# Altium schematic sheet P1.schdoc
size 297 x 209 mm; Symbol: Drawing-Symbol_A4; @Project Name: New Project_2026-08-12_18-40-16; @Page Count: 1; @Update Date: 2026-08-12; @Create Date: 2026-08-12; @Schematic Name: Schematic1; @Page No: 1; @Page Name: P1; Company: EasyEDA.com; Version: V1.0; Page Size: A4; Device: Drawing-Symbol_A4; @Create Time: 18:40:18; @Update Time: 18:40:18; Border: 1; Width: 1170; Height: 825; Region Start: 1; X Region Count: 6; Y Region Count: 4; Blade Width: 10; Title Block Position: 3; @Board Name: Board1
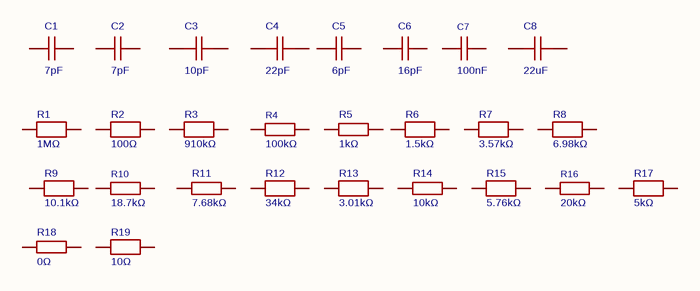
[diagram p0: P1.schdoc]

## Parts
C1  7pF  [C0603]
C2  7pF  [C0603]
C3  10pF  [C0805]
C4  22pF  [C0805]
C5  6pF  [C0805]
C6  16pF  [C0805]
C7  100nF  [C0805]
C8  22uF  [C0805]
R1  1MΩ  [R0805]
R2  100Ω  [R0805]
R3  910kΩ  [R0805]
R4  100kΩ  [R0805]
R5  1kΩ  [R0805]
R6  1.5kΩ  [R0805]
R7  3.57kΩ  [R0805]
R8  6.98kΩ  [R0805]
R9  10.1kΩ  [R0805]
R10  18.7kΩ  [R0805]
R11  7.68kΩ  [R0805]
R12  34kΩ  [R0805]
R13  3.01kΩ  [R0805]
R14  10kΩ  [R0805]
R15  5.76kΩ  [R0805]
R16  20kΩ  [R0805]
R17  5kΩ  [R0805]
R18  0Ω  [R0805]
R19  10Ω  [R0805]

## Nets

Not connected (* = marked no-connect by the designer): C1 1 2; C2 1 2; C3 1 2; C4 1 2; C5 1 2; C6 1 2; C7 1 2; C8 1 2; R1 1 2; R2 1 2; R3 1 2; R4 1 2; R5 1 2; R6 1 2; R7 1 2; R8 1 2; R9 1 2; R10 1 2; R11 1 2; R12 1 2; R13 1 2; R14 1 2; R15 1 2; R16 1 2; R17 1 2; R18 1 2; R19 1 2

## Notes on the sheet
- Create at
- 2026-08-12
- Schematic
- Board
- Schematic1
- Board1
- Update at
- Page
- P1
- Drawn
- Reviewed
- New Project_2026-08-12_18-40-16
- Version
- V1.0
- Size
- A4
- Page  1  Total  1
- EasyEDA.com

## Library data of the parts
C1 C2 = 0603CG7R0C500NT: Capacitance:7pF Voltage Rating:50V Temperature Coefficient:C0G; Manufacturer: FH(风华); AddInBom: yes; ModelId: 624118aa3cc7497086c383c2d72e08520819f05c4eef4c71ace90d822a990e87; ModelName: C0603_L1.6-W0.8-H0.8; ModelTransform: 62.992,31.496,0,0,0,0,0,0,0; Voltage Rating: 50V; Temperature Coefficient: C0G; Symbol: 0603CG7R0C500NT; Device: 0603CG7R0C500NT; LCSC Part Name: ±0.25pF 7pF 50V; SupplierPart: C1682; ManufacturerPart: 0603CG7R0C500NT; Supplier Footprint: 0603; JLCPCB Part Class: Extended Part; Datasheet: https://item.szlcsc.com/datasheet/0603CG7R0C500NT/2034.html; Supplier: LCSC; ConvertToPcb: yes; FootprintName: C0603; Value: 7pF
C3 = VJ0805A100FXACW1BC: Capacitance:10pF Tolerance:±1% Tolerance:±1% Voltage Rating:50V Temperature Coefficient:C0G; Manufacturer: VISHAY(威世); AddInBom: yes; ModelId: 8c88e81f49c6409b980720ec8953afb60819f05c4eef4c71ace90d822a990e87; ModelName: C0805_L2.0-W1.3-H1.3; ModelTransform: 78.74,51.181,0,0,0,0,0,0.0005,0; Tolerance: ±1%; Voltage Rating: 50V; Temperature Coefficient: C0G; Symbol: VJ0805A100FXACW1BC; Device: VJ0805A100FXACW1BC; LCSC Part Name: 10pF ±1% 50V; SupplierPart: C2177610; ManufacturerPart: VJ0805A100FXACW1BC; Supplier Footprint: 0805; JLCPCB Part Class: Extended Part; Datasheet: https://item.szlcsc.com/datasheet/VJ0805A100FXACW1BC/2269676.html; Supplier: LCSC; ConvertToPcb: yes; FootprintName: C0805; Value: 10pF
C4 = 0805CG220F500NT: Capacitance:22pF Tolerance:±1% Tolerance:±1% Voltage Rating:50V Temperature Coefficient:C0G; Manufacturer: FH(风华); AddInBom: yes; ModelId: 8c88e81f49c6409b980720ec8953afb60819f05c4eef4c71ace90d822a990e87; ModelName: C0805_L2.0-W1.3-H1.3; ModelTransform: 78.74,51.181,0,0,0,0,0,0.0005,0; Tolerance: ±1%; Voltage Rating: 50V; Temperature Coefficient: C0G; Symbol: 0805CG220F500NT; Device: 0805CG220F500NT; LCSC Part Name: 22pF ±1% 50V; SupplierPart: C190088; ManufacturerPart: 0805CG220F500NT; Supplier Footprint: 0805; JLCPCB Part Class: Extended Part; Datasheet: https://item.szlcsc.com/datasheet/0805CG220F500NT/208470.html; Supplier: LCSC; ConvertToPcb: yes; FootprintName: C0805; Value: 22pF
C5 = 0805CG6R0C500NT_C67560: Capacitance:6pF Voltage Rating:50V Temperature Coefficient:C0G; Manufacturer: FH(风华); AddInBom: yes; ModelId: 8c88e81f49c6409b980720ec8953afb60819f05c4eef4c71ace90d822a990e87; ModelName: C0805_L2.0-W1.3-H1.3; ModelTransform: 78.74,51.181,0,0,0,0,0,0.0005,0; Voltage Rating: 50V; Temperature Coefficient: C0G; Symbol: 0805CG6R0C500N; Device: 0805CG6R0C500NT_C67560; LCSC Part Name: ±0.25pF 6pF 50V; SupplierPart: C67560; ManufacturerPart: 0805CG6R0C500NT; Supplier Footprint: 0805; JLCPCB Part Class: Extended Part; Datasheet: https://item.szlcsc.com/datasheet/0805CG6R0C500NT/68656.html; Supplier: LCSC; ConvertToPcb: yes; FootprintName: C0805; Value: 6pF
C6 = 0805CG160J500NT: Capacitance:16pF Tolerance:±5% Tolerance:±5% Voltage Rating:50V Temperature Coefficient:C0G; Manufacturer: FH(风华); AddInBom: yes; ModelId: 8c88e81f49c6409b980720ec8953afb60819f05c4eef4c71ace90d822a990e87; ModelName: C0805_L2.0-W1.3-H1.3; ModelTransform: 78.74,51.181,0,0,0,0,0,0.0005,0; Tolerance: ±5%; Voltage Rating: 50V; Temperature Coefficient: C0G; Symbol: 0805CG160J500NT; Device: 0805CG160J500NT; LCSC Part Name: 16pF ±5% 50V; SupplierPart: C1796; ManufacturerPart: 0805CG160J500NT; Supplier Footprint: 0805; JLCPCB Part Class: Extended Part; Datasheet: https://item.szlcsc.com/datasheet/0805CG160J500NT/2148.html; Supplier: LCSC; ConvertToPcb: yes; FootprintName: C0805; Value: 16pF
C7 = CC0805JRX7R9BB104: Capacitance:100nF Tolerance:±5% Tolerance:±5% Voltage Rating:50V Temperature Coefficient:X7R; Manufacturer: YAGEO(国巨); AddInBom: yes; ModelId: 8c88e81f49c6409b980720ec8953afb60819f05c4eef4c71ace90d822a990e87; ModelName: C0805_L2.0-W1.3-H1.3; ModelTransform: 78.74,51.181,0,0,0,0,0,0.0005,0; Tolerance: ±5%; Voltage Rating: 50V; Temperature Coefficient: X7R; Symbol: CC0805JRX7R9BB104; Device: CC0805JRX7R9BB104; Supplier: LCSC; Manufacturer Part: CC0805JRX7R9BB104; Value: 100nF; Supplier Part: C111492; JLCPCB Part Class: Extended Part; LCSC Part Name: 100nF ±5% 50V; Supplier Footprint: 0805; Datasheet: https://item.szlcsc.com/datasheet/CC0805JRX7R9BB104/112720.html; ConvertToPcb: yes; FootprintName: C0805
C8 = TCC0805X5R226K100FT: Capacitance:22uF Tolerance:±10% Tolerance:±10% Voltage Rating:10V Temperature Coefficient:X5R; Manufacturer: CCTC(三环); AddInBom: yes; ModelId: 8c88e81f49c6409b980720ec8953afb60819f05c4eef4c71ace90d822a990e87; ModelName: C0805_L2.0-W1.3-H1.3; ModelTransform: 78.74,51.181,0,0,0,0,0,0.0005,0; Tolerance: ±10%; Voltage Rating: 10V; Temperature Coefficient: X5R; Symbol: TCC0805X5R226K100FT; Device: TCC0805X5R226K100FT; LCSC Part Name: 22uF ±10% 10V; SupplierPart: C380336; ManufacturerPart: TCC0805X5R226K100FT; Supplier Footprint: 0805; JLCPCB Part Class: Extended Part; Datasheet: https://item.szlcsc.com/datasheet/TCC0805X5R226K100FT/352741.html; Supplier: LCSC; ConvertToPcb: yes; FootprintName: C0805; Value: 22uF
R1 = FRC0805F1004TS: Type:Thick Film Resistor Resistance:1MΩ Tolerance:±1% Tolerance:±1% Power(Watts):125mW Voltage-Supply(Max):150V Temperature Coefficient:±100ppm/℃ Temperature Coefficient:±100ppm/℃ Operating Temperature:-55℃~+155℃ Operating Temperature:-55℃~+155℃; Manufacturer: FOJAN(富捷); AddInBom: yes; ModelId: b83c7c5430874b8eb2319a65d94334290819f05c4eef4c71ace90d822a990e87; ModelName: R0805_L2.0-W1.3-H0.6; ModelTransform: 78.74,51.181,0,0,0,0,0,-0.0005,0; Tolerance: ±1%; Power(Watts): 125mW; Voltage-Supply(Max): 150V; Symbol: FRC0805F1004TS; Device: FRC0805F1004TS; LCSC Part Name: 1MΩ ±1% 125mW 厚膜电阻; SupplierPart: C2933280; ManufacturerPart: FRC0805F1004TS; Supplier Footprint: 0805; JLCPCB Part Class: Extended Part; Supplier: LCSC; ConvertToPcb: yes; FootprintName: R0805; Type: Thick Film Resistor; Value: 1MΩ; Temperature Coefficient: ±100ppm/℃; Operating Temperature: -55℃~+155℃
R2 = FRC0805F1000TS: Type:Thick Film Resistor Resistance:100Ω Tolerance:±1% Tolerance:±1% Power(Watts):125mW Voltage-Supply(Max):150V Temperature Coefficient:±100ppm/℃ Temperature Coefficient:±100ppm/℃ Operating Temperature:-55℃~+155℃ Operating Temperature:-55℃~+155℃; Manufacturer: FOJAN(富捷); AddInBom: yes; ModelId: b83c7c5430874b8eb2319a65d94334290819f05c4eef4c71ace90d822a990e87; ModelName: R0805_L2.0-W1.3-H0.6; ModelTransform: 78.74,51.181,0,0,0,0,0,-0.0005,0; Tolerance: ±1%; Power(Watts): 125mW; Voltage-Supply(Max): 150V; Symbol: FRC0805F1000TS; Device: FRC0805F1000TS; LCSC Part Name: 100Ω ±1% 125mW 厚膜电阻; SupplierPart: C2907218; ManufacturerPart: FRC0805F1000TS; Supplier Footprint: 0805; JLCPCB Part Class: Extended Part; Datasheet: https://item.szlcsc.com/datasheet/FRC0805F1000TS/3180731.html; Supplier: LCSC; ConvertToPcb: yes; FootprintName: R0805; Type: Thick Film Resistor; Value: 100Ω; Temperature Coefficient: ±100ppm/℃; Operating Temperature: -55℃~+155℃
R3 = FRC0805F9103TS: Type:Thick Film Resistor Resistance:910kΩ Tolerance:±1% Tolerance:±1% Power(Watts):125mW Voltage-Supply(Max):150V Temperature Coefficient:±100ppm/℃ Temperature Coefficient:±100ppm/℃ Operating Temperature:-55℃~+155℃ Operating Temperature:-55℃~+155℃; Manufacturer: FOJAN(富捷); AddInBom: yes; ModelId: b83c7c5430874b8eb2319a65d94334290819f05c4eef4c71ace90d822a990e87; ModelName: R0805_L2.0-W1.3-H0.6; ModelTransform: 78.74,51.181,0,0,0,0,0,-0.0005,0; Tolerance: ±1%; Power(Watts): 125mW; Voltage-Supply(Max): 150V; Symbol: FRC0805F9103TS; Device: FRC0805F9103TS; LCSC Part Name: 910kΩ ±1% 125mW 厚膜电阻; SupplierPart: C2999461; ManufacturerPart: FRC0805F9103TS; Supplier Footprint: 0805; JLCPCB Part Class: Extended Part; Supplier: LCSC; ConvertToPcb: yes; FootprintName: R0805; Type: Thick Film Resistor; Value: 910kΩ; Temperature Coefficient: ±100ppm/℃; Operating Temperature: -55℃~+155℃
R4 = 0805W8F1003T5E: Type:Thick Film Resistor Resistance:100kΩ Tolerance:±1% Tolerance:±1% Power(Watts):125mW Voltage-Supply(Max):150V Temperature Coefficient:±100ppm/℃ Temperature Coefficient:±100ppm/℃ Operating Temperature:-55℃~+155℃ Operating Temperature:-55℃~+155℃; Manufacturer: UNI-ROYAL(厚声); Symbol: 0805W8F1003T5E_C149504; AddInBom: yes; ModelId: b83c7c5430874b8eb2319a65d94334290819f05c4eef4c71ace90d822a990e87; ModelName: R0805_L2.0-W1.3-H0.6; ModelTransform: 78.74,51.181,0,0,0,0,0,-0.0005,0; Tolerance: ±1%; Power(Watts): 125mW; Voltage-Supply(Max): 150V; Device: 0805W8F1003T5E; Supplier: LCSC; Supplier Part: C149504; Manufacturer Part: 0805W8F1003T5E; Value: 100kΩ; JLCPCB Part Class: Basic Part; LCSC Part Name: 100kΩ ±1% 125mW 厚膜电阻; Supplier Footprint: 0805; Datasheet: https://item.szlcsc.com/datasheet/0805W8F1003T5E/160838.html; ConvertToPcb: yes; FootprintName: R0805; Type: Thick Film Resistor; Temperature Coefficient: ±100ppm/℃; Operating Temperature: -55℃~+155℃
R5 = 0805W8F1001T5E: Type:Thick Film Resistors Resistance:1kΩ Tolerance:±1% Tolerance:±1% Power(Watts): Overload Voltage (Max): Temperature Coefficient:±100ppm/℃ Temperature Coefficient:±100ppm/℃ Operating Temperature Range:-55℃~+155℃ Operating Temperature Range:-55℃~+155℃; Manufacturer: UNI-ROYAL(厚声); AddInBom: yes; ModelId: b83c7c5430874b8eb2319a65d94334290819f05c4eef4c71ace90d822a990e87; ModelName: R0805_L2.0-W1.3-H0.6; ModelTransform: 78.74,51.181,0,0,0,0,0,-0.0005,0; Tolerance: ±1%; Symbol: 0805W8F1001T5E; Device: 0805W8F1001T5E; LCSC Part Name: 1kΩ ±1% 125mW 厚膜电阻; SupplierPart: C17513; ManufacturerPart: 0805W8F1001T5E; Supplier Footprint: 0805; JLCPCB Part Class: Basic Part; Datasheet: https://atta.szlcsc.com/upload/public/pdf/source/20200306/C422600_1E6D84923E4A46A82E41ADD87F860B5C.pdf; Supplier: LCSC; ConvertToPcb: yes; FootprintName: R0805; Type: Thick Film Resistors; Value: 1kΩ; Temperature Coefficient: ±100ppm/℃; Operating Temperature Range: -55℃~+155℃
R6 = FRC0805F1501TS: Type:Thick Film Resistor Resistance:1.5kΩ Tolerance:±1% Tolerance:±1% Power(Watts):125mW Voltage-Supply(Max):150V Temperature Coefficient:±100ppm/℃ Temperature Coefficient:±100ppm/℃ Operating Temperature:-55℃~+155℃ Operating Temperature:-55℃~+155℃; Manufacturer: FOJAN(富捷); AddInBom: yes; ModelId: b83c7c5430874b8eb2319a65d94334290819f05c4eef4c71ace90d822a990e87; ModelName: R0805_L2.0-W1.3-H0.6; ModelTransform: 78.74,51.181,0,0,0,0,0,-0.0005,0; Tolerance: ±1%; Power(Watts): 125mW; Voltage-Supply(Max): 150V; Symbol: FRC0805F1501TS; Device: FRC0805F1501TS; LCSC Part Name: 1.5kΩ ±1% 125mW 厚膜电阻; SupplierPart: C2907216; ManufacturerPart: FRC0805F1501TS; Supplier Footprint: 0805; JLCPCB Part Class: Extended Part; Supplier: LCSC; ConvertToPcb: yes; FootprintName: R0805; Type: Thick Film Resistor; Value: 1.5kΩ; Temperature Coefficient: ±100ppm/℃; Operating Temperature: -55℃~+155℃
R7 = FRC0805F3571TS: Type:Thick Film Resistor Resistance:3.57kΩ Tolerance:±1% Tolerance:±1% Power(Watts):125mW Voltage-Supply(Max):150V Temperature Coefficient:±100ppm/℃ Temperature Coefficient:±100ppm/℃ Operating Temperature:-55℃~+155℃ Operating Temperature:-55℃~+155℃; Manufacturer: FOJAN(富捷); AddInBom: yes; ModelId: b83c7c5430874b8eb2319a65d94334290819f05c4eef4c71ace90d822a990e87; ModelName: R0805_L2.0-W1.3-H0.6; ModelTransform: 78.74,51.181,0,0,0,0,0,-0.0005,0; Tolerance: ±1%; Power(Watts): 125mW; Voltage-Supply(Max): 150V; Symbol: FRC0805F3571TS; Device: FRC0805F3571TS; LCSC Part Name: 3.57kΩ ±1% 125mW 厚膜电阻; SupplierPart: C2933425; ManufacturerPart: FRC0805F3571TS; Supplier Footprint: 0805; JLCPCB Part Class: Extended Part; Datasheet: https://item.szlcsc.com/datasheet/FRC0805F3571TS/3279527.html; Supplier: LCSC; ConvertToPcb: yes; FootprintName: R0805; Type: Thick Film Resistor; Value: 3.57kΩ; Temperature Coefficient: ±100ppm/℃; Operating Temperature: -55℃~+155℃
R8 = FRC0805F6981TS: Type:Thick Film Resistor Resistance:6.98kΩ Tolerance:±1% Tolerance:±1% Power(Watts):125mW Voltage-Supply(Max):150V Temperature Coefficient:±100ppm/℃ Temperature Coefficient:±100ppm/℃ Operating Temperature:-55℃~+155℃ Operating Temperature:-55℃~+155℃; Manufacturer: FOJAN(富捷); AddInBom: yes; ModelId: b83c7c5430874b8eb2319a65d94334290819f05c4eef4c71ace90d822a990e87; ModelName: R0805_L2.0-W1.3-H0.6; ModelTransform: 78.74,51.181,0,0,0,0,0,-0.0005,0; Tolerance: ±1%; Power(Watts): 125mW; Voltage-Supply(Max): 150V; Symbol: FRC0805F6981TS; Device: FRC0805F6981TS; LCSC Part Name: 6.98kΩ ±1% 125mW 厚膜电阻; SupplierPart: C2933489; ManufacturerPart: FRC0805F6981TS; Supplier Footprint: 0805; JLCPCB Part Class: Extended Part; Datasheet: https://item.szlcsc.com/datasheet/FRC0805F6981TS/3279591.html; Supplier: LCSC; ConvertToPcb: yes; FootprintName: R0805; Type: Thick Film Resistor; Value: 6.98kΩ; Temperature Coefficient: ±100ppm/℃; Operating Temperature: -55℃~+155℃
R9 = RT0805BRD0710K1L: Type:Thin Film Resistor Resistance:10.1kΩ Tolerance:±0.1% Tolerance:±0.1% Power(Watts):125mW Temperature Coefficient:±25ppm/℃ Temperature Coefficient:±25ppm/℃ Operating Temperature:-55℃~+155℃ Operating Temperature:-55℃~+155℃; Manufacturer: YAGEO(国巨); AddInBom: yes; ModelId: b83c7c5430874b8eb2319a65d94334290819f05c4eef4c71ace90d822a990e87; ModelName: R0805_L2.0-W1.3-H0.6; ModelTransform: 78.74,51.181,0,0,0,0,0,-0.0005,0; Tolerance: ±0.1%; Power(Watts): 125mW; Symbol: RT0805BRD0710K1L; Device: RT0805BRD0710K1L; LCSC Part Name: 薄膜电阻 10.1kΩ ±0.1% 125mW; SupplierPart: C865133; ManufacturerPart: RT0805BRD0710K1L; Supplier Footprint: 0805; JLCPCB Part Class: Extended Part; Datasheet: https://item.szlcsc.com/datasheet/RT0805BRD0710K1L/925214.html; Supplier: LCSC; ConvertToPcb: yes; FootprintName: R0805; Type: Thin Film Resistor; Value: 10.1kΩ; Temperature Coefficient: ±25ppm/℃; Operating Temperature: -55℃~+155℃
R10 = 0805W8F1872T5E: Type:Thick Film Resistor Resistance:18.7kΩ Tolerance:±1% Tolerance:±1% Power(Watts):125mW Voltage-Supply(Max):150V Temperature Coefficient:±100ppm/℃ Temperature Coefficient:±100ppm/℃ Operating Temperature:-55℃~+155℃ Operating Temperature:-55℃~+155℃; Manufacturer: UNI-ROYAL(厚声); AddInBom: yes; ModelId: b83c7c5430874b8eb2319a65d94334290819f05c4eef4c71ace90d822a990e87; ModelName: R0805_L2.0-W1.3-H0.6; ModelTransform: 78.74,51.181,0,0,0,0,0,-0.0005,0; Tolerance: ±1%; Power(Watts): 125mW; Voltage-Supply(Max): 150V; Symbol: 0805W8F1872T5E; Device: 0805W8F1872T5E; Supplier: LCSC; Manufacturer Part: 0805W8F1872T5E; Supplier Part: C17499; Value: 18.7kΩ; JLCPCB Part Class: Extended Part; LCSC Part Name: 18.7kΩ ±1% 125mW 厚膜电阻; Supplier Footprint: 0805; Datasheet: https://item.szlcsc.com/datasheet/0805W8F1872T5E/18187.html; ConvertToPcb: yes; FootprintName: R0805; Type: Thick Film Resistor; Temperature Coefficient: ±100ppm/℃; Operating Temperature: -55℃~+155℃
R11 = RC0805FR-077K68L: Type:Thick Film Resistor Resistance:7.68kΩ Tolerance:±1% Tolerance:±1% Power(Watts):125mW Voltage-Supply(Max):150V Temperature Coefficient:±100ppm/℃ Temperature Coefficient:±100ppm/℃ Operating Temperature:-55℃~+155℃ Operating Temperature:-55℃~+155℃; Manufacturer: YAGEO(国巨); AddInBom: yes; ModelId: b83c7c5430874b8eb2319a65d94334290819f05c4eef4c71ace90d822a990e87; ModelName: R0805_L2.0-W1.3-H0.6; ModelTransform: 78.74,51.181,0,0,0,0,0,-0.0005,0; Tolerance: ±1%; Power(Watts): 125mW; Voltage-Supply(Max): 150V; Symbol: RC0805FR-077K68L; Device: RC0805FR-077K68L; LCSC Part Name: 厚膜电阻 7.68kΩ ±1% 125mW; SupplierPart: C273951; ManufacturerPart: RC0805FR-077K68L; Supplier Footprint: 0805; JLCPCB Part Class: Extended Part; Datasheet: https://item.szlcsc.com/datasheet/RC0805FR-077K68L/262366.html; Supplier: LCSC; ConvertToPcb: yes; FootprintName: R0805; Type: Thick Film Resistor; Value: 7.68kΩ; Temperature Coefficient: ±100ppm/℃; Operating Temperature: -55℃~+155℃
R12 = FRC0805F3402TS: Type:Thick Film Resistor Resistance:34kΩ Tolerance:±1% Tolerance:±1% Power(Watts):125mW Voltage-Supply(Max):150V Temperature Coefficient:±100ppm/℃ Temperature Coefficient:±100ppm/℃ Operating Temperature:-55℃~+155℃ Operating Temperature:-55℃~+155℃; Manufacturer: FOJAN(富捷); AddInBom: yes; ModelId: b83c7c5430874b8eb2319a65d94334290819f05c4eef4c71ace90d822a990e87; ModelName: R0805_L2.0-W1.3-H0.6; ModelTransform: 78.74,51.181,0,0,0,0,0,-0.0005,0; Tolerance: ±1%; Power(Watts): 125mW; Voltage-Supply(Max): 150V; Symbol: FRC0805F3402TS; Device: FRC0805F3402TS; LCSC Part Name: 34kΩ ±1% 125mW 厚膜电阻; SupplierPart: C2933420; ManufacturerPart: FRC0805F3402TS; Supplier Footprint: 0805; JLCPCB Part Class: Extended Part; Datasheet: https://item.szlcsc.com/datasheet/FRC0805F3402TS/3279522.html; Supplier: LCSC; ConvertToPcb: yes; FootprintName: R0805; Type: Thick Film Resistor; Value: 34kΩ; Temperature Coefficient: ±100ppm/℃; Operating Temperature: -55℃~+155℃
R13 = FRC0805F3011TS: Type:Thick Film Resistor Resistance:3.01kΩ Tolerance:±1% Tolerance:±1% Power(Watts):125mW Voltage-Supply(Max):150V Temperature Coefficient:±100ppm/℃ Temperature Coefficient:±100ppm/℃ Operating Temperature:-55℃~+155℃ Operating Temperature:-55℃~+155℃; Manufacturer: FOJAN(富捷); AddInBom: yes; ModelId: b83c7c5430874b8eb2319a65d94334290819f05c4eef4c71ace90d822a990e87; ModelName: R0805_L2.0-W1.3-H0.6; ModelTransform: 78.74,51.181,0,0,0,0,0,-0.0005,0; Tolerance: ±1%; Power(Watts): 125mW; Voltage-Supply(Max): 150V; Symbol: FRC0805F3011TS; Device: FRC0805F3011TS; LCSC Part Name: 3.01kΩ ±1% 125mW 厚膜电阻; SupplierPart: C2999485; ManufacturerPart: FRC0805F3011TS; Supplier Footprint: 0805; JLCPCB Part Class: Extended Part; Datasheet: https://item.szlcsc.com/datasheet/FRC0805F3011TS/3476925.html; Supplier: LCSC; ConvertToPcb: yes; FootprintName: R0805; Type: Thick Film Resistor; Value: 3.01kΩ; Temperature Coefficient: ±100ppm/℃; Operating Temperature: -55℃~+155℃
R14 = 0805W8F1002T5E: Type:Thick Film Resistor Resistance:10kΩ Tolerance:±1% Tolerance:±1% Power(Watts):125mW Voltage-Supply(Max):150V Temperature Coefficient:±100ppm/℃ Temperature Coefficient:±100ppm/℃ Operating Temperature:-55℃~+155℃ Operating Temperature:-55℃~+155℃; Manufacturer: UNI-ROYAL(厚声); AddInBom: yes; ModelId: b83c7c5430874b8eb2319a65d94334290819f05c4eef4c71ace90d822a990e87; ModelName: R0805_L2.0-W1.3-H0.6; ModelTransform: 78.74,51.181,0,0,0,0,0,-0.0005,0; Tolerance: ±1%; Power(Watts): 125mW; Voltage-Supply(Max): 150V; Symbol: 0805W8F1002T5E; Device: 0805W8F1002T5E; LCSC Part Name: 10kΩ ±1% 125mW 厚膜电阻; SupplierPart: C17414; ManufacturerPart: 0805W8F1002T5E; Supplier Footprint: 0805; JLCPCB Part Class: Basic Part; Datasheet: https://item.szlcsc.com/datasheet/0805W8F1002T5E/18102.html; Supplier: LCSC; ConvertToPcb: yes; FootprintName: R0805; Type: Thick Film Resistor; Value: 10kΩ; Temperature Coefficient: ±100ppm/℃; Operating Temperature: -55℃~+155℃
R15 = FRC0805F5761TS: Type:Thick Film Resistor Resistance:5.76kΩ Tolerance:±1% Tolerance:±1% Power(Watts):125mW Voltage-Supply(Max):150V Temperature Coefficient:±100ppm/℃ Temperature Coefficient:±100ppm/℃ Operating Temperature:-55℃~+155℃ Operating Temperature:-55℃~+155℃; Manufacturer: FOJAN(富捷); AddInBom: yes; ModelId: b83c7c5430874b8eb2319a65d94334290819f05c4eef4c71ace90d822a990e87; ModelName: R0805_L2.0-W1.3-H0.6; ModelTransform: 78.74,51.181,0,0,0,0,0,-0.0005,0; Tolerance: ±1%; Power(Watts): 125mW; Voltage-Supply(Max): 150V; Symbol: FRC0805F5761TS; Device: FRC0805F5761TS; LCSC Part Name: 5.76kΩ ±1% 125mW 厚膜电阻; SupplierPart: C3000533; ManufacturerPart: FRC0805F5761TS; Supplier Footprint: 0805; JLCPCB Part Class: Extended Part; Supplier: LCSC; ConvertToPcb: yes; FootprintName: R0805; Type: Thick Film Resistor; Value: 5.76kΩ; Temperature Coefficient: ±100ppm/℃; Operating Temperature: -55℃~+155℃
R16 = 0805W8F2002T5E: Type:Thick Film Resistors Resistance:20kΩ Tolerance:±1% Tolerance:±1% Power(Watts): Overload Voltage (Max): Temperature Coefficient:±100ppm/℃ Temperature Coefficient:±100ppm/℃ Operating Temperature Range:-55℃~+155℃ Operating Temperature Range:-55℃~+155℃; Manufacturer: UNI-ROYAL(厚声); AddInBom: yes; ModelId: b83c7c5430874b8eb2319a65d94334290819f05c4eef4c71ace90d822a990e87; ModelName: R0805_L2.0-W1.3-H0.6; ModelTransform: 78.74,51.181,0,0,0,0,0,-0.0005,0; Tolerance: ±1%; Symbol: 0805W8F2002T5E; Device: 0805W8F2002T5E; Supplier: LCSC; Manufacturer Part: 0805W8F2002T5E; Supplier Part: C4328; Value: 20kΩ; JLCPCB Part Class: Basic Part; LCSC Part Name: 20kΩ ±1% 125mW 厚膜电阻; Supplier Footprint: 0805; Datasheet: https://atta.szlcsc.com/upload/public/pdf/source/20200306/C422600_1E6D84923E4A46A82E41ADD87F860B5C.pdf; ConvertToPcb: yes; FootprintName: R0805; Type: Thick Film Resistors; Temperature Coefficient: ±100ppm/℃; Operating Temperature Range: -55℃~+155℃
R17 = ARG05DTC5001: Type:Thin Film Resistor Resistance: Tolerance:±0.5% Tolerance:±0.5% Power(Watts): Overload Voltage (Max): Temperature Coefficient:±25ppm/℃ Temperature Coefficient:±25ppm/℃ Operating Temperature Range:-55℃~+155℃ Operating Temperature Range:-55℃~+155℃; Manufacturer: Viking(光颉); AddInBom: yes; ModelId: b83c7c5430874b8eb2319a65d94334290819f05c4eef4c71ace90d822a990e87; ModelName: R0805_L2.0-W1.3-H0.6; ModelTransform: 78.74,51.181,0,0,0,0,0,-0.0005,0; Tolerance: ±0.5%; Symbol: ARG05DTC5001; Device: ARG05DTC5001; LCSC Part Name: 薄膜电阻 5kΩ ±0.5% 125mW; SupplierPart: C2828783; ManufacturerPart: ARG05DTC5001; Supplier Footprint: 0805; JLCPCB Part Class: Extended Part; Datasheet: https://atta.szlcsc.com/upload/public/pdf/source/20211009/C2828883_CAE7D170B8B230FC4A048BDC7B3A81FC.pdf; Supplier: LCSC; ConvertToPcb: yes; FootprintName: R0805; Type: Thin Film Resistor; Value: 5kΩ; Temperature Coefficient: ±25ppm/℃; Operating Temperature Range: -55℃~+155℃
R18 = 0805W8F0000T5E_C17477: Type:Thick Film Resistor Resistance:0Ω Tolerance:±1% Tolerance:±1% Power(Watts):125mW Voltage-Supply(Max):150V Temperature Coefficient:±800ppm/℃ Temperature Coefficient:±800ppm/℃ Operating Temperature:-55℃~+155℃ Operating Temperature:-55℃~+155℃; Manufacturer: UNI-ROYAL(厚声); AddInBom: yes; ModelId: b83c7c5430874b8eb2319a65d94334290819f05c4eef4c71ace90d822a990e87; ModelName: R0805_L2.0-W1.3-H0.6; ModelTransform: 78.74,51.181,0,0,0,0,0,-0.0005,0; Tolerance: ±1%; Power(Watts): 125mW; Voltage-Supply(Max): 150V; Symbol: 0805W8F0000T5E; Device: 0805W8F0000T5E_C17477; LCSC Part Name: 0Ω ±1% 125mW 厚膜电阻; SupplierPart: C17477; ManufacturerPart: 0805W8F0000T5E; Supplier Footprint: 0805; JLCPCB Part Class: Basic Part; Datasheet: https://item.szlcsc.com/datasheet/0805W8F0000T5E/18165.html; Supplier: LCSC; ConvertToPcb: yes; FootprintName: R0805; Type: Thick Film Resistor; Value: 0Ω; Temperature Coefficient: ±800ppm/℃; Operating Temperature: -55℃~+155℃
R19 = FRC0805F10R0TS: Type:Thick Film Resistor Resistance:10Ω Tolerance:±1% Tolerance:±1% Power(Watts):125mW Voltage-Supply(Max):150V Temperature Coefficient:±200ppm/℃ Temperature Coefficient:±200ppm/℃ Operating Temperature:-55℃~+155℃ Operating Temperature:-55℃~+155℃; Manufacturer: FOJAN(富捷); AddInBom: yes; ModelId: b83c7c5430874b8eb2319a65d94334290819f05c4eef4c71ace90d822a990e87; ModelName: R0805_L2.0-W1.3-H0.6; ModelTransform: 78.74,51.181,0,0,0,0,0,-0.0005,0; Tolerance: ±1%; Power(Watts): 125mW; Voltage-Supply(Max): 150V; Symbol: FRC0805F10R0TS; Device: FRC0805F10R0TS; LCSC Part Name: 10Ω ±1% 125mW 厚膜电阻; SupplierPart: C2907220; ManufacturerPart: FRC0805F10R0TS; Supplier Footprint: 0805; JLCPCB Part Class: Extended Part; Datasheet: https://item.szlcsc.com/datasheet/FRC0805F10R0TS/3180733.html; Supplier: LCSC; ConvertToPcb: yes; FootprintName: R0805; Type: Thick Film Resistor; Value: 10Ω; Temperature Coefficient: ±200ppm/℃; Operating Temperature: -55℃~+155℃